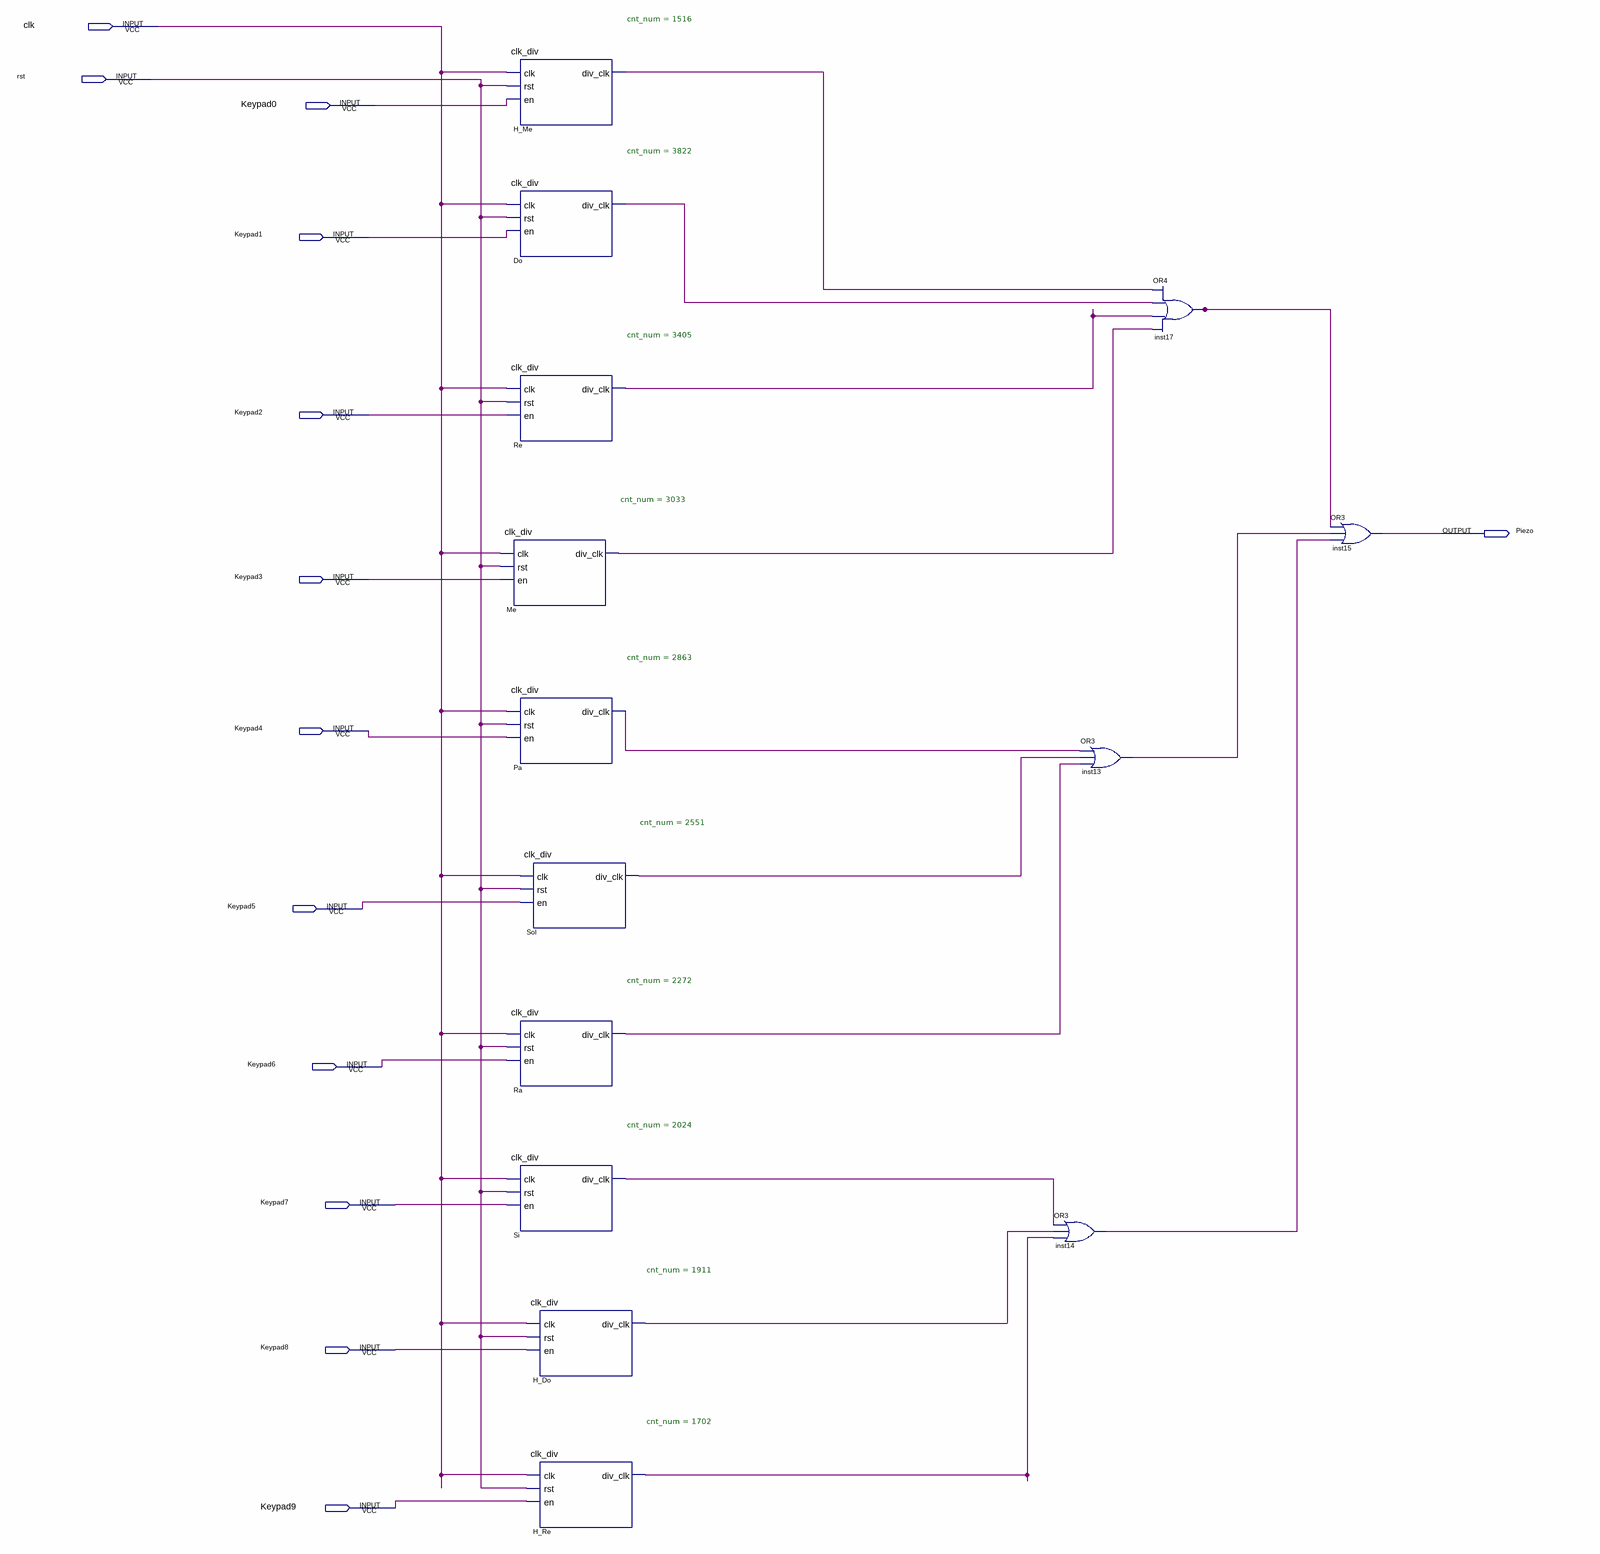
[diagram p0: schematic sheet]
// Quartus schematic Piezo_module.bdf as structural Verilog: 14 symbols, 13 pins
module Piezo_module (
  input  clk,
  input  rst,
  input  Keypad0,
  input  Keypad1,
  input  Keypad2,
  input  Keypad3,
  input  Keypad4,
  input  Keypad5,
  input  Keypad6,
  input  Keypad7,
  input  Keypad8,
  input  Keypad9,
  output Piezo
);

  wire Do_div_clk, H_Do_div_clk, H_Me_div_clk, H_Re_div_clk, inst13_out, inst14_out, inst17_out, Me_div_clk,
       Pa_div_clk, Ra_div_clk, Re_div_clk, Si_div_clk, Sol_div_clk;

  clk_div #(.cnt_num(1516)) H_Me (.clk(clk), .rst(rst), .en(Keypad0), .div_clk(H_Me_div_clk));
  clk_div #(.cnt_num(3822)) Do (.clk(clk), .rst(rst), .en(Keypad1), .div_clk(Do_div_clk));
  clk_div #(.cnt_num(3405)) Re (.clk(clk), .rst(rst), .en(Keypad2), .div_clk(Re_div_clk));
  clk_div #(.cnt_num(3033)) Me (.clk(clk), .rst(rst), .en(Keypad3), .div_clk(Me_div_clk));
  clk_div #(.cnt_num(2863)) Pa (.clk(clk), .rst(rst), .en(Keypad4), .div_clk(Pa_div_clk));
  clk_div #(.cnt_num(2551)) Sol (.clk(clk), .rst(rst), .en(Keypad5), .div_clk(Sol_div_clk));
  clk_div #(.cnt_num(2272)) Ra (.clk(clk), .rst(rst), .en(Keypad6), .div_clk(Ra_div_clk));
  clk_div #(.cnt_num(2024)) Si (.clk(clk), .rst(rst), .en(Keypad7), .div_clk(Si_div_clk));
  clk_div #(.cnt_num(1911)) H_Do (.clk(clk), .rst(rst), .en(Keypad8), .div_clk(H_Do_div_clk));
  clk_div #(.cnt_num(1702)) H_Re (.clk(clk), .rst(rst), .en(Keypad9), .div_clk(H_Re_div_clk));
  or inst13 (inst13_out, Pa_div_clk, Sol_div_clk, Ra_div_clk);
  or inst14 (inst14_out, Si_div_clk, H_Do_div_clk, H_Re_div_clk);
  or inst17 (inst17_out, H_Me_div_clk, Do_div_clk, Re_div_clk, Me_div_clk);
  or inst15 (Piezo, inst17_out, inst13_out, inst14_out);
endmodule
